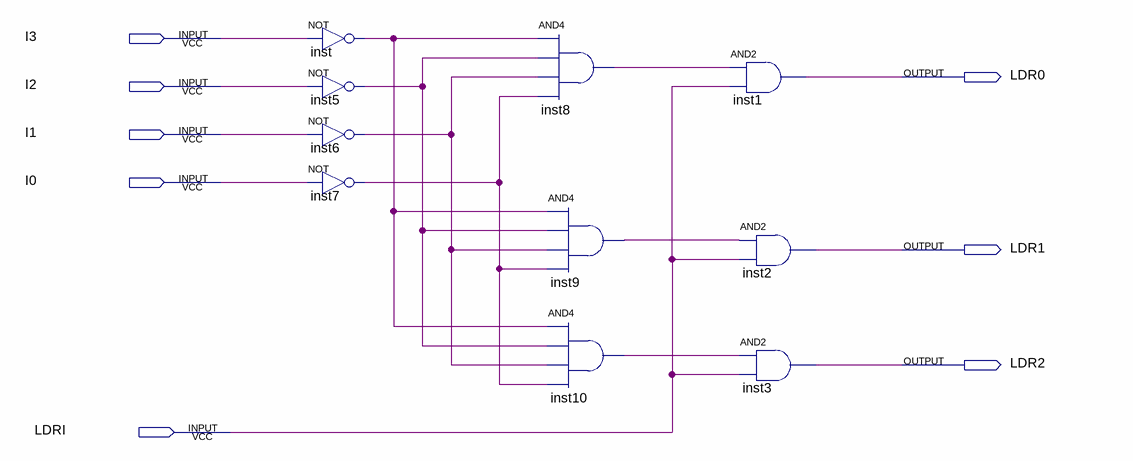
[diagram p0: schematic sheet]
// Quartus schematic Idro_2.bdf as structural Verilog: 10 symbols, 8 pins
module Idro_2 (
  input  I3,
  input  I2,
  input  I1,
  input  I0,
  input  LDRI,
  output LDR0,
  output LDR1,
  output LDR2
);

  wire inst5_out, inst6_out, inst7_out, inst8_out, inst9_out, inst10_out, inst_out;

  not inst (inst_out, I3);
  not inst5 (inst5_out, I2);
  not inst6 (inst6_out, I1);
  not inst7 (inst7_out, I0);
  and inst8 (inst8_out, inst_out, inst5_out, inst6_out, inst7_out);
  and inst9 (inst9_out, inst_out, inst5_out, inst6_out, inst7_out);
  and inst10 (inst10_out, inst_out, inst5_out, inst6_out, inst7_out);
  and inst1 (LDR0, inst8_out, LDRI);
  and inst2 (LDR1, inst9_out, LDRI);
  and inst3 (LDR2, inst10_out, LDRI);
endmodule
